# Altium schematic sheet P07_Peripheral.SchDoc
size A4; SheetNumber: 7; SheetTotal: 7
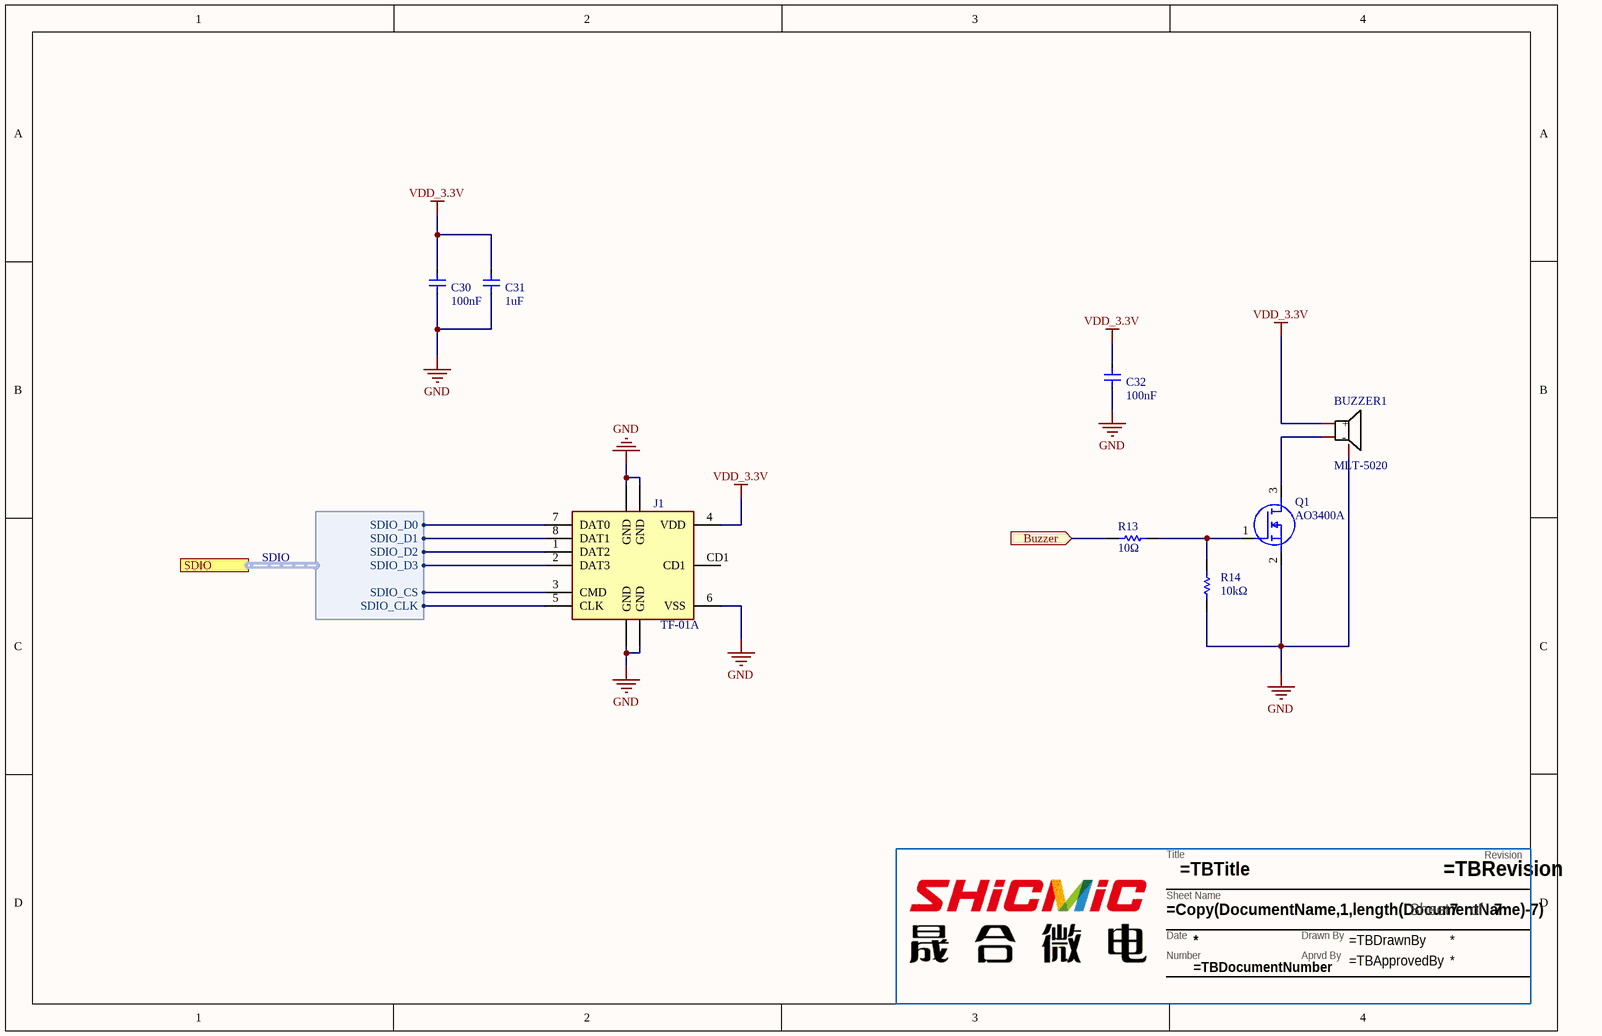
[diagram p0: P07_Peripheral.SchDoc]

## Parts
??  TitleBlock  (value not drawn)  (graphical)
BUZZER1  4000Hz  [BUZ-SMD_L5.0-W5.5-P4.60]  (value not drawn)
C30  100nF  [CAP_0402]
C31  1uF  [CAP_0402]
C32  100nF  [CAP_0402]
J1  TF-01A  [TF01A]
Q1  AO3400A  [SOT95P280X125-3N]
R13  10Ω  [RES_0402]
R14  10kΩ  [RES_0402]

## Ports
Buzzer (in), SDIO (harness SDIO)

## Harnesses
SDIO: SDIO_CLK, SDIO_CS, SDIO_D0, SDIO_D1, SDIO_D2, SDIO_D3

## Nets
GND: BUZZER1.3(NC) C30.2 C31.2 C32.2 J1.6(VSS) J1.MP1(GND) J1.MP2(GND) J1.MP3(GND) J1.MP4(GND) Q1.2(S) R14.1
VDD_3.3V: BUZZER1.1(+) C30.1 C31.1 C32.1 J1.4(VDD)
Buzzer: R13.2 ; port Buzzer
NetBUZZER1_2: BUZZER1.2(-) Q1.3(D)
NetJ1_1: J1.1(DAT2) ; port SDIO.SDIO_D2
NetJ1_2: J1.2(DAT3) ; port SDIO.SDIO_D3
NetJ1_3: J1.3(CMD) ; port SDIO.SDIO_CS
NetJ1_5: J1.5(CLK) ; port SDIO.SDIO_CLK
NetJ1_7: J1.7(DAT0) ; port SDIO.SDIO_D0
NetJ1_8: J1.8(DAT1) ; port SDIO.SDIO_D1
NetQ1_1: Q1.1(G) R13.1 R14.2

Not connected (* = marked no-connect by the designer): J1 CD1

## Notes on the sheet
- (in symbol TitleBlock) Revision; Title; Sheet Name; Sheet; of; Date; Drawn By; Number; Aprvd By

## Library data of the parts
?? = TitleBlock: Title block for Ambiq Schematics. Please have the following parameters entered in Project>Project Options>Parameters: / TBTitle / TBDocumentNumber / TBRevision / TBDrawnBy / TBApprovedBy; AMBIQ PN: TitleBlock
BUZZER1 = MLT-5020: Manufacturer: 华能; Add into BOM: yes; Oscillator Circuit: 无源(外部驱动); Technology Type: 电磁式; Name: 4000Hz; Symbol: MLT-5020; LCSC Part Name: MLT-5020; Supplier Part: C94598; Manufacturer Part: MLT-5020; Supplier Footprint: SMD,5x5mm; JLCPCB Part Class: 扩展库; Datasheet: https://atta.szlcsc.com/upload/public/pdf/source/20210811/111454390007D221D7259018FB170E62.pdf; Supplier: LCSC; Convert to PCB: yes; Value: 4000Hz; Length: 5.2mm; Width: 5.2mm; Height: 2.5mm; Device: MLT-5020
C30 C32 = Capacitor: NONE; Manufacturer: Kyocera AVX; AMBIQ PN: 0201ZD104KAT2A; Tolerance: 10%; Voltage Rating: 10V; Supplier 1: Arrow Electronics; Supplier Part Number 1: 0201ZD104KAT2A; Manufacturer Part Number: 0201ZD104KAT2A; RoHS: Yes; Category: Ceramic Capacitors; Stock 1: 105000; Pricing 1: 15000=0.00770, 30000=0.00750, 45000=0.00740, 60000=0.00720, 75000=0.00690, 150000=0.00620 (USD); Mount: Surface Mount; Case/Package: 0201; Case Code (Metric): 0603; Case Code (Imperial): 0201; Min Operating Temperature: -55°C; Max Operating Temperature: 85°C; Capacitance: 100nF; Packaging: Tape and Reel; Voltage Rating (DC): 10V; Series: -; Lead Free: Lead Free; RoHS Compliant: Yes; ComponentLink1URL: http://www.mouser.com/ds/2/40/cx5r-776519.pdf?src-supplier=Mouser; ComponentLink1Description: http://www.mouser.com/ds/2/40/cx5r-776519.pdf?src-supplier=Mouser
C31 = Capacitor: NONE; Manufacturer: Samsung; Manufacturer Part Number: CL05A105MP5NNNC; AMBIQ PN: CL05A105KP5NNNC; Tolerance: 20%; Voltage Rating: 10V; Dielectric: X5R; Supplier 1: Newark; Supplier Part Number 1: 82AC9184; RoHS: Yes; Category: Ceramic Capacitors; Mount: Surface Mount; Case/Package: 0402; Case Code (Metric): 1005; Case Code (Imperial): 0402; Min Operating Temperature: -55°C; Max Operating Temperature: 85°C; Capacitance: 1uF; Packaging: Tape and Reel; Voltage Rating (DC): 10V; Series: CL; Construction: Flat; Length: 1mm; Width: 0.02inch; Height: 0.5mm; Thickness: 0.022inch; Depth: 0.5mm; Radiation Hardening: No; Lead Free: Lead Free; RoHS Compliant: Yes; ComponentLink1URL: https://datasheet.ciiva.com/25802/cl05a105mp5nnnc-25802049.pdf?src-supplier=Digi-Key; ComponentLink1Description: https://datasheet.ciiva.com/25802/cl05a105mp5nnnc-25802049.pdf?src-supplier=Digi-Key; Package Quantity: 1
J1 = TF-01A: Connector; Manufacturer_Name: Korean Hroparts Elec; Datasheet Link: https://datasheet.lcsc.com/szlcsc/1903221101_Korean-Hroparts-Elec-TF-01A_C91145.pdf; Height: 1.85mm; Manufacturer_Part_Number: TF-01A
Q1 = AO3400A: MOSFET (N-Channel); Manufacturer_Name: Alpha & Omega Semiconductors; Datasheet Link: http://aosmd.com/res/data_sheets/AO3400A.pdf; Height: 1.25mm; Manufacturer_Part_Number: AO3400A; Arrow Part Number: AO3400A; Arrow Price/Stock: https://www.arrow.com/en/products/ao3400a/alpha-and-omega-semiconductor?region=nac
R13 R14 = Resistor: Surface Mount Thick Film Resistor, Rc Series, 10 Kohm, 62.5 Mw, - 1%, 50 V, 0402 [1005 Metric]; Manufacturer: Yageo; AMBIQ PN: RC0402FR-0710KL; Resistance: 10kR; Power Rating: 62.5mW; Voltage Rating: 50V; Max Power Dissipation: 63mW; Temperature Coefficient: 100ppm/°C; Supplier 1: Arrow Electronics; Supplier Part Number 1: RC0402FR-0710KL; Manufacturer Part Number: RC0402FR-0710KL; RoHS: Yes; Category: Chip SMD Resistors; Stock 1: 7776428; Pricing 1: 10000=0.00210 (USD); Case/Package: 0402; Case Code (Metric): 1005; Case Code (Imperial): 0402; Min Operating Temperature: -55°C; Max Operating Temperature: 155°C; Packaging: Tape and Reel; Resistor Type: Thick Film; Number of Terminations: 2; Termination: SMD/SMT; Voltage Rating (DC): 50V; Features: Moisture Resistant; Series: RC; Construction: Rectangular; Length: 1mm; Width: 0.5mm; Height: 0.32mm; Depth: 0.5mm; REACH SVHC: No SVHC; Military Standard: Not; Lead Free: Lead Free; RoHS Compliant: Yes; ComponentLink1URL: https://datasheet.ciiva.com/7660/38568-7660787.pdf?src-supplier=Element14; ComponentLink1Description: https://datasheet.ciiva.com/7660/38568-7660787.pdf?src-supplier=Element14; ComponentLink2URL: https://datasheet.ciiva.com/7849/1686128-7849814.pdf?src-supplier=Element14; ComponentLink2Description: https://datasheet.ciiva.com/7849/1686128-7849814.pdf?src-supplier=Element14; ComponentLink3URL: https://datasheet.ciiva.com/7983/1018594-7983486.pdf?src-supplier=Element14; Tolerance: 1%; Number of Pins: 2; Resistance Tolerance: 1%; Working Voltage: 50V; Lead Pitch: 0.2mm